# EasyEDA Pro project EasyEDA_ChisFlash_V1.0_Prometheus.epro

# Schematic ChisFlash-Prometheus
Create Date: 2024-07-21; Page Name: P1; Project Name: ChisFlash-Prometheus; Schematic Name: ChisFlash-Prometheus; Update Date: 2024-07-21; Company: ChisBread/ChisFlash-Prometheus; Drawed: ChisBread; Page Size: A4; Reviewed: ChisBread; Version: 2
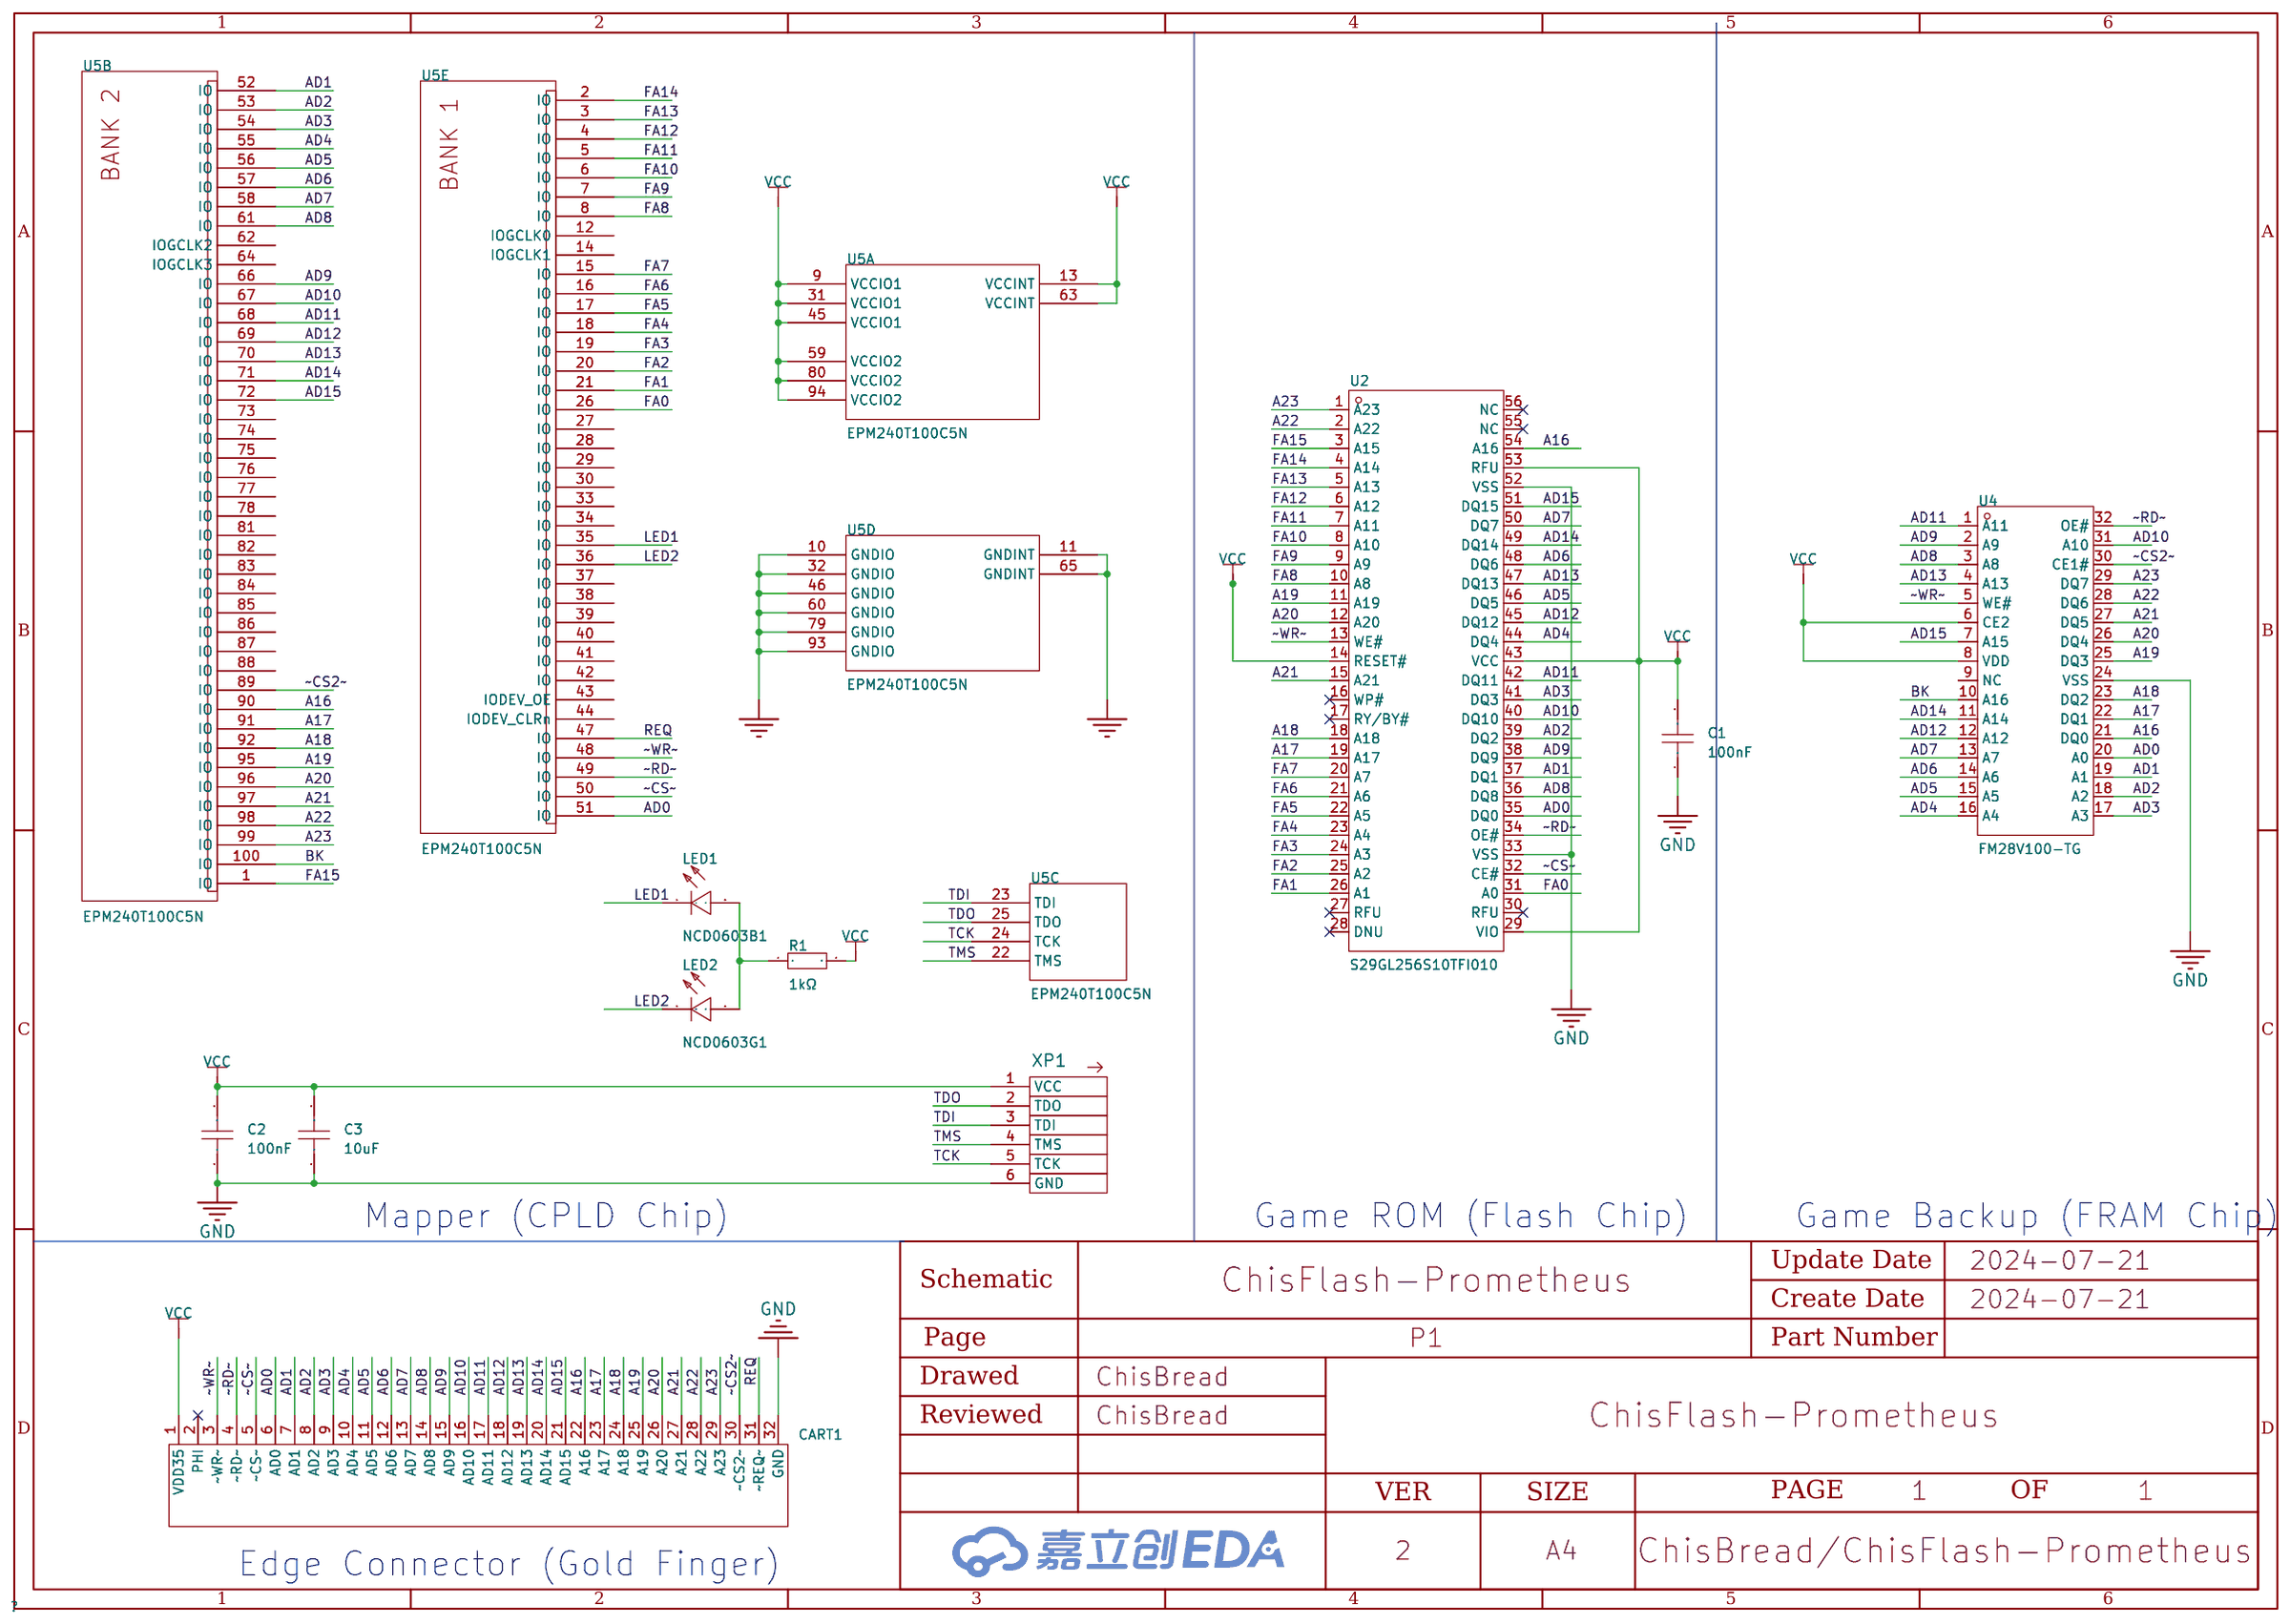
[diagram p0: schematic sheet]

## Parts
C1  100nF  [C0603]
C2  100nF  [C0603]
C3  10uF  [C0603]
CART1  -  [GBACartridge]  (no BOM)
LED1  NCD0603B1  [LED0603-RD]
LED2  NCD0603G1  [LED0603-RD]
R1  1kΩ  [R0603]
U2  S29GL256S10TFI010  [TSOP-56_L18.4-W14.0-P0.50-LS20.0-TL]
U4  FM28V100-TG  [STSOP-32_L8.0-W11.8-P0.50-LS13.4-TL]
U5  EPM240T100C5N  [TQFP-100_L14.0-W14.0-P0.50-LS16.0-BL]  (sections 1,2,3,4,5)
XP1  JTAG  [HDR-TH_6P-P1.27-V-M-1]  (no BOM)

## Library data of the parts
C1 C2 = CAP_0603: Supplier Footprint: 0603
C3 = CL10A106MA8NRNC: 容值:10uF;精度:±20%;额定电压:25V;材质(温度系数):X5R;; LCSC Part Name: 10uF ±20% 25V; Supplier Part: C96446; Manufacturer: SAMSUNG(三星); Supplier Footprint: 0603; JLCPCB Part Class: 基础库; Datasheet: https://atta.szlcsc.com/upload/public/pdf/source/20160218/1457707763339.pdf; Supplier: LCSC; Tolerance: ±20%; Voltage Rated: 25V; Temperature Coefficient: X5R
CART1 = GBACartridge: GBA Cartridge
LED1 = NCD0603B1: 发光颜色:蓝色;正向电压(VF):2.6V~3.6V;功率:72mW;正向电流:10mA;主波长:463nm~475nm;透镜颜色:无色透明透镜;发光强度:80mcd~220mcd;发光角度:130°;工作温度:-30℃~+85℃;; Supplier Part: C84266; Manufacturer: 国星光电; Supplier Footprint: 0603; JLCPCB Part Class: 扩展库; Datasheet: https://atta.szlcsc.com/upload/public/pdf/source/20200820/C84266_6A3CDBEFA72C6CAD68EDA53474ADAE6C.pdf; Supplier: LCSC; Emitted Color: 蓝色; Forward Voltage (VF): 2.6V~3.6V; Power Dissipation: 72mW; Forward Current: 10mA; Dominant Wavelength: 463nm~475nm; Lens Color: 无色透明透镜; Luminous Intensity: 80mcd~220mcd; Viewing Angle: 130°; Operating Temperature: -30℃~+85℃
LED2 = NCD0603G1: 发光颜色:翠绿色;正向电压(VF):2.6V~3.6V;功率:72mW;正向电流:10mA;主波长:515nm~530nm;透镜颜色:无色透明透镜;发光强度:330mcd~900mcd;发光角度:130°;工作温度:-30℃~+85℃;; Supplier Part: C84267; Manufacturer: 国星光电; Supplier Footprint: 0603; JLCPCB Part Class: 扩展库; Datasheet: https://atta.szlcsc.com/upload/public/pdf/source/20200820/C84267_04BA7703640BAC111D09F5EFB971FBF3.pdf; Supplier: LCSC; Emitted Color: 翠绿色; Forward Voltage (VF): 2.6V~3.6V; Power Dissipation: 72mW; Forward Current: 10mA; Dominant Wavelength: 515nm~530nm; Lens Color: 无色透明透镜; Luminous Intensity: 330mcd~900mcd; Viewing Angle: 130°; Operating Temperature: -30℃~+85℃
R1 = 0603WAF1001T5E: 电阻类型:厚膜电阻;阻值:1kΩ;精度:±1%;功率:100mW;最大工作电压:75V;温度系数:±100ppm/℃;; LCSC Part Name: 1kΩ ±1% 100mW 厚膜电阻; Supplier Part: C21190; Manufacturer: UNI-ROYAL(厚声); Supplier Footprint: 0603; JLCPCB Part Class: 基础库; Datasheet: https://atta.szlcsc.com/upload/public/pdf/source/20200306/C422600_1E6D84923E4A46A82E41ADD87F860B5C.pdf; Supplier: LCSC; Type: 厚膜电阻; Tolerance: ±1%; Power(Watts): 100mW; Overload Voltage (Max): 75V; Temperature Coefficient: ±100ppm/℃; Operating Temperature Range: -55℃~+155℃
U2 = S29GL256S10TFI010: Supplier Part: C1350995; Manufacturer: SPANSION(飞索); Supplier Footprint: TSOP-56; JLCPCB Part Class: Extended Part; Datasheet: https://atta.szlcsc.com/upload/public/pdf/source/20201109/C914940_4A5E28132C9BE0EE19A790F58F84C86D.pdf; Supplier: LCSC
U4 = FM28V100-TG: Supplier Part: C2959453; Manufacturer: CYPRESS(赛普拉斯); Supplier Footprint: TFSOP-32; JLCPCB Part Class: 扩展库; Datasheet: https://atta.szlcsc.com/upload/public/pdf/source/20210608/2F2AEFEDCE558E0D37969C616959BD3C.pdf; Supplier: LCSC
U5 = EPM240T100C5N: 类型:其它PLD;逻辑门数量:-;逻辑单元数:-;逻辑阵列块数:240;; Supplier Part: C10041; Manufacturer: Intel/Altera; Supplier Footprint: TQFP-100(14x14); JLCPCB Part Class: 扩展库; Datasheet: https://atta.szlcsc.com/upload/public/pdf/source/20121123/1457706563537.pdf; Supplier: LCSC; Type: 其它PLD; Supply Voltage Range - VCCIO: 3.3V；2.5V; Logic Array Blocks: 240; Maximum Delay Time Tpd: 4.7ns; Operating Temperature Range: 0℃~+85℃
XP1 = jtag

## Nets
GND: C1.1 C2.1 C3.1 CART1.32(GND) U2.33(VSS) U2.52(VSS) U4.24(VSS) U5.10(GNDIO) U5.11(GNDINT) U5.32(GNDIO) U5.46(GNDIO) U5.60(GNDIO) U5.65(GNDINT) U5.79(GNDIO) U5.93(GNDIO) XP1.6(GND)
VCC: C1.2 C2.2 C3.2 CART1.1(VDD35) R1.2 U2.14(RESET#) U2.29(VIO) U2.43(VCC) U2.53(RFU) U4.6(CE2) U4.8(VDD) U5.9(VCCIO1) U5.13(VCCINT) U5.31(VCCIO1) U5.45(VCCIO1) U5.59(VCCIO2) U5.63(VCCINT) U5.80(VCCIO2) U5.94(VCCIO2) XP1.1(VCC)
A16: CART1.22(A16) U2.54(A16) U4.21(DQ0) U5.90(IO)
A17: CART1.23(A17) U2.19(A17) U4.22(DQ1) U5.91(IO)
A18: CART1.24(A18) U2.18(A18) U4.23(DQ2) U5.92(IO)
A19: CART1.25(A19) U2.11(A19) U4.25(DQ3) U5.95(IO)
A20: CART1.26(A20) U2.12(A20) U4.26(DQ4) U5.96(IO)
A21: CART1.27(A21) U2.15(A21) U4.27(DQ5) U5.97(IO)
A22: CART1.28(A22) U2.2(A22) U4.28(DQ6) U5.98(IO)
A23: CART1.29(A23) U2.1(A23) U4.29(DQ7) U5.99(IO)
AD0: CART1.6(AD0) U2.35(DQ0) U4.20(A0) U5.51(IO)
AD1: CART1.7(AD1) U2.37(DQ1) U4.19(A1) U5.52(IO)
AD2: CART1.8(AD2) U2.39(DQ2) U4.18(A2) U5.53(IO)
AD3: CART1.9(AD3) U2.41(DQ3) U4.17(A3) U5.54(IO)
AD4: CART1.10(AD4) U2.44(DQ4) U4.16(A4) U5.55(IO)
AD5: CART1.11(AD5) U2.46(DQ5) U4.15(A5) U5.56(IO)
AD6: CART1.12(AD6) U2.48(DQ6) U4.14(A6) U5.57(IO)
AD7: CART1.13(AD7) U2.50(DQ7) U4.13(A7) U5.58(IO)
AD8: CART1.14(AD8) U2.36(DQ8) U4.3(A8) U5.61(IO)
AD9: CART1.15(AD9) U2.38(DQ9) U4.2(A9) U5.66(IO)
AD10: CART1.16(AD10) U2.40(DQ10) U4.31(A10) U5.67(IO)
AD11: CART1.17(AD11) U2.42(DQ11) U4.1(A11) U5.68(IO)
AD12: CART1.18(AD12) U2.45(DQ12) U4.12(A12) U5.69(IO)
AD13: CART1.19(AD13) U2.47(DQ13) U4.4(A13) U5.70(IO)
AD14: CART1.20(AD14) U2.49(DQ14) U4.11(A14) U5.71(IO)
AD15: CART1.21(AD15) U2.51(DQ15) U4.7(A15) U5.72(IO)
BK: U4.10(A16) U5.100(IO)
FA0: U2.31(A0) U5.26(IO)
FA1: U2.26(A1) U5.21(IO)
FA2: U2.25(A2) U5.20(IO)
FA3: U2.24(A3) U5.19(IO)
FA4: U2.23(A4) U5.18(IO)
FA5: U2.22(A5) U5.17(IO)
FA6: U2.21(A6) U5.16(IO)
FA7: U2.20(A7) U5.15(IO)
FA8: U2.10(A8) U5.8(IO)
FA9: U2.9(A9) U5.7(IO)
FA10: U2.8(A10) U5.6(IO)
FA11: U2.7(A11) U5.5(IO)
FA12: U2.6(A12) U5.4(IO)
FA13: U2.5(A13) U5.3(IO)
FA14: U2.4(A14) U5.2(IO)
FA15: U2.3(A15) U5.1(IO)
LED1: LED1.1(-) U5.35(IO)
LED2: LED2.1(K) U5.36(IO)
REQ: CART1.31(~REQ~) U5.47(IO)
TCK: U5.24(TCK) XP1.5(TCK)
TDI: U5.23(TDI) XP1.3(TDI)
TDO: U5.25(TDO) XP1.2(TDO)
TMS: U5.22(TMS) XP1.4(TMS)
~CS2~: CART1.30(~CS2~) U4.30(CE1#) U5.89(IO)
~CS~: CART1.5(~CS~) U2.32(CE#) U5.50(IO)
~RD~: CART1.4(~RD~) U2.34(OE#) U4.32(OE#) U5.49(IO)
~WR~: CART1.3(~WR~) U2.13(WE#) U4.5(WE#) U5.48(IO)
$1N77583: LED1.2(+) LED2.2(A) R1.1

Not connected (* = marked no-connect by the designer): CART1 2(PHI)*; U2 16(WP#)* 17(RY/BY#)* 27(RFU)* 28(DNU)* 30(RFU)* 55(NC)* 56(NC)*; U4 9(NC); U5 12(IOGCLK0) 14(IOGCLK1) 27(IO) 28(IO) 29(IO) 30(IO) 33(IO) 34(IO) 37(IO) 38(IO) 39(IO) 40(IO) 41(IO) 42(IO) 43(IODEV_OE) 44(IODEV_CLRn) 62(IOGCLK2) 64(IOGCLK3) 73(IO) 74(IO) 75(IO) 76(IO) 77(IO) 78(IO) 81(IO) 82(IO) 83(IO) 84(IO) 85(IO) 86(IO) 87(IO) 88(IO)

## Notes on the sheet
- Mapper (CPLD Chip)
- Game ROM (Flash Chip)
- Game Backup (FRAM Chip)
- Edge Connector (Gold Finger)

# Board ChisFlash-Prometheus
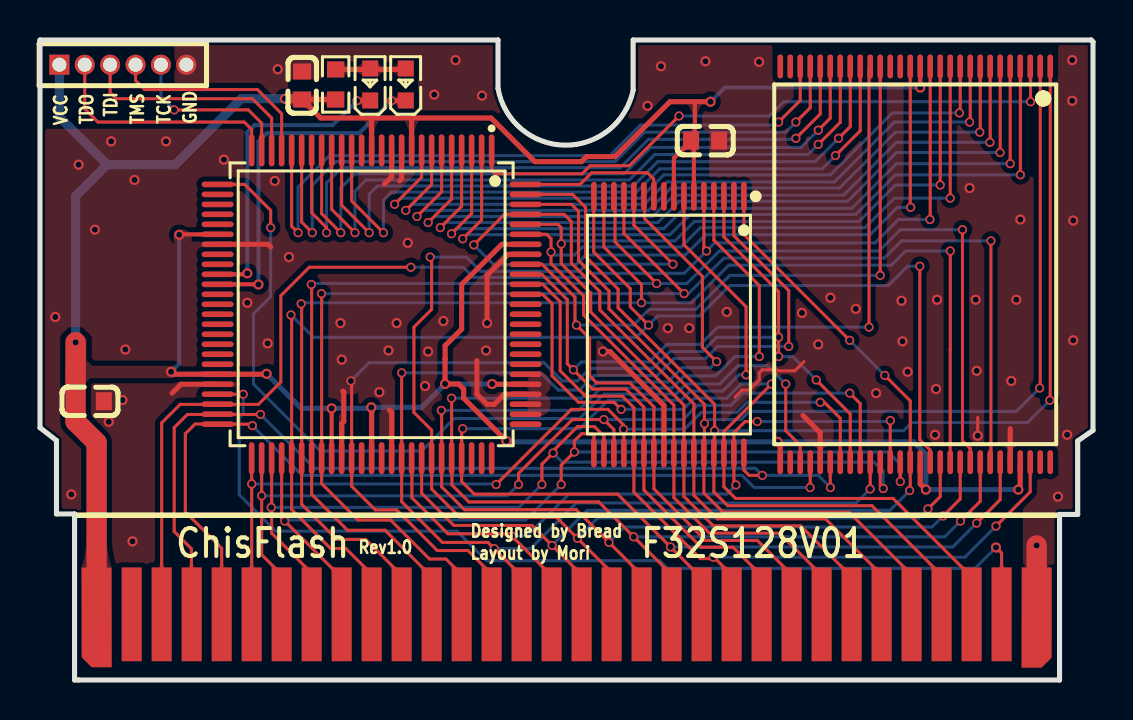
[diagram p1: board, top side]
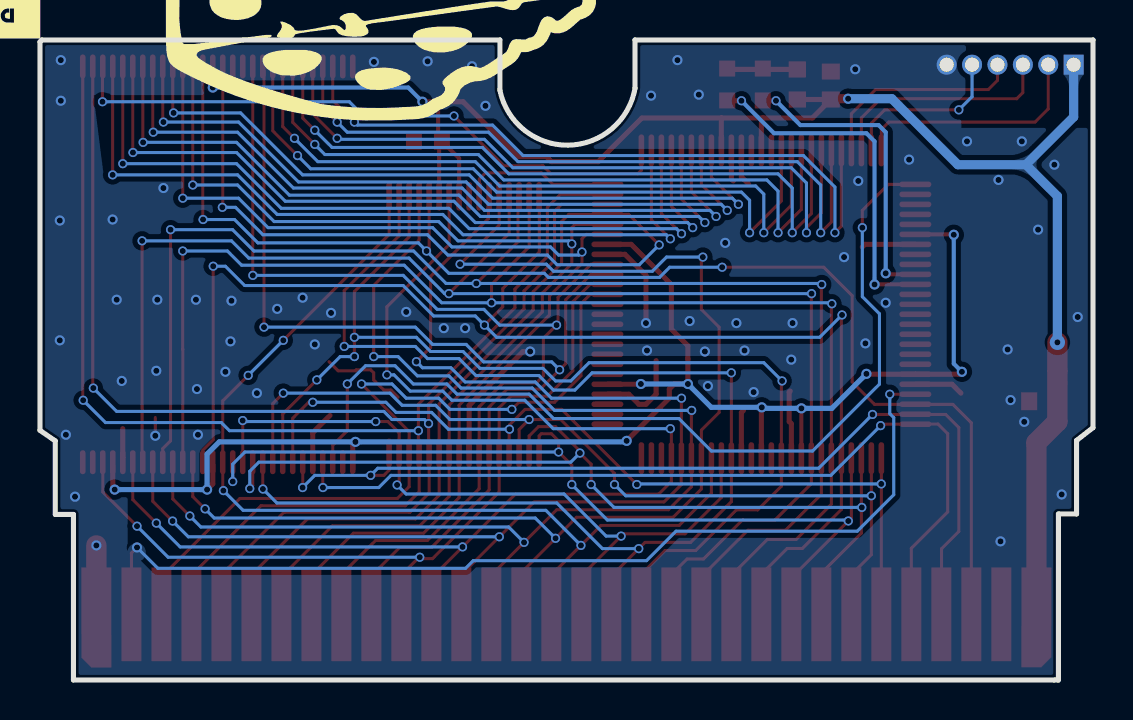
[diagram p2: board, bottom side, seen from below]

Outline 52.66 x 32.03 mm; copper layers: Top Layer, Bottom Layer. Coordinates in mm from the lower left corner of the outline.
Outline path: 0,32.03 22.9,32.03 22.9,29.6 arc(26.24,26.76) 29.66,29.51 29.66,32.03 52.56,32.03 52.66,31.93 52.66,12.49 51.89,11.96 51.89,8.29 50.98,8.29 50.98,0 1.93,0 1.73,0 1.73,8.31 0.82,8.31 0.82,11.98 0,12.63 0,32.03
Stack: Top Layer 0.035mm - / Dielectric1 1.51mm FR4 er 4.5 / Bottom Layer 0.035mm -

## Design rules (mm)
template: 自定义配置
spacing copperThickness1oz (default): track to track 0.152, other pairs 0.152 to 0.3
spacing copperThickness2oz: track to track 0.152, other pairs 0.152 to 0.3
track width copperThickness1oz (default): min 0.152, default 0.203, max 2.54
track width copperThickness2oz: min 0.152, default 0.254, max 2.54
differential pair differentialPair (default): width min 0.152, default 0.254, max 2.54; gap min 0.152, default 0.152
via viaSize (default): diameter min 0.406, default 0.508, max 10; hole min 0.305, default 0.305, max 6.299

## Placement (name value [footprint] x y rotation side)
C1  100nF  [C0603]  33.26 26.99 180 top
C2  100nF  [C0603]  13.11 29.75 270 top
C3  10uF  [C0603]  2.49 13.95 180 top
CART1  -  [GBACartridge]  26.31 18.09 0 top
LED1  NCD0603B1  [LED0603-RD]  16.51 29.8 90 top
LED2  NCD0603G1  [LED0603-RD]  18.29 29.8 90 top
R1  1kΩ  [R0603]  14.79 29.8 270 top
U2  S29GL256S10TFI010  [TSOP-56_L18.4-W14.0-P0.50-LS20.0-TL]  43.77 20.8 270 top
U4  FM28V100-TG  [STSOP-32_L8.0-W11.8-P0.50-LS13.4-TL]  31.45 17.78 270 top
U5  EPM240T100C5N  [TQFP-100_L14.0-W14.0-P0.50-LS16.0-BL]  16.58 18.8 180 top
XP1  JTAG  [HDR-TH_6P-P1.27-V-M-1]  4.14 30.79 0 top

## Footprints (pads in the part's own frame, mm; a bottom-side part is the same pattern mirrored in y, then rotated)
C0603
  rect 0.8x0.9 smd: 1(-0.7,0) 2(0.7,0)
GBACartridge
  custom 1.509x4.995 smd: 1(-23.479,-14.958)
  custom 1x4.691 smd: 2(-21.724,-14.806) 3(-20.224,-14.806) 4(-18.724,-14.806) 5(-17.224,-14.806) 6(-15.725,-14.806) 7(-14.225,-14.806) 8(-12.725,-14.806) 9(-11.225,-14.806) 10(-9.725,-14.806) 11(-8.225,-14.806) 12(-6.724,-14.806) 13(-5.224,-14.806) 14(-3.724,-14.806) 15(-2.224,-14.806) 16(-0.725,-14.806) 17(0.775,-14.806) 18(2.276,-14.806) 19(3.776,-14.806) 20(5.276,-14.806) 21(6.776,-14.806) 22(8.275,-14.806) 23(9.775,-14.806) 24(11.275,-14.806) 25(12.775,-14.806) 26(14.275,-14.806) 27(15.775,-14.806) 28(17.276,-14.806) 29(18.776,-14.806) 30(20.276,-14.806) 31(21.776,-14.806)
  custom 1.506x5.012 smd: 32(23.529,-14.966)
HDR-TH_6P-P1.27-V-M-1
  rect 1x1 hole 0.7: 1(-3.175,0)
  round 1 hole 0.7: 2(-1.905,0) 3(-0.635,0) 4(0.635,0) 5(1.905,0) 6(3.175,0)
LED0603-RD
  rect 0.8x0.8 smd: 1(-0.799,0) 2(0.799,0)
R0603
  rect 0.806x0.864 smd: 1(-0.753,0) 2(0.753,0)
STSOP-32_L8.0-W11.8-P0.50-LS13.4-TL
  oval 1.44x0.28 smd: 1(-6.42,3.75) 2(-6.42,3.25) 3(-6.42,2.75) 4(-6.42,2.25) 5(-6.42,1.75) 6(-6.42,1.25) 7(-6.42,0.75) 8(-6.42,0.25) 9(-6.42,-0.25) 10(-6.42,-0.75) 11(-6.42,-1.25) 12(-6.42,-1.75) 13(-6.42,-2.25) 14(-6.42,-2.75) 15(-6.42,-3.25) 16(-6.42,-3.75) 17(6.42,-3.75) 18(6.42,-3.25) 19(6.42,-2.75) 20(6.42,-2.25) 21(6.42,-1.75) 22(6.42,-1.25) 23(6.42,-0.75) 24(6.42,-0.25) 25(6.42,0.25) 26(6.42,0.75) 27(6.42,1.25) 28(6.42,1.75) 29(6.42,2.25) 30(6.42,2.75) 31(6.42,3.25) 32(6.42,3.75)
TQFP-100_L14.0-W14.0-P0.50-LS16.0-BL
  oval 0.28x1.6 smd: 1(-6,-7.7) 2(-5.5,-7.7) 3(-5,-7.7) 4(-4.5,-7.7) 5(-4,-7.7) 6(-3.5,-7.7) 7(-3,-7.7) 8(-2.5,-7.7) 9(-2,-7.7) 10(-1.5,-7.7) 11(-1,-7.7) 12(-0.5,-7.7) 13(0,-7.7) 14(0.5,-7.7) 15(1,-7.7) 16(1.5,-7.7) 17(2,-7.7) 18(2.5,-7.7) 19(3,-7.7) 20(3.5,-7.7) 21(4,-7.7) 22(4.5,-7.7) 23(5,-7.7) 24(5.5,-7.7) 25(6,-7.7) 51(6,7.7) 52(5.5,7.7) 53(5,7.7) 54(4.5,7.7) 55(4,7.7) 56(3.5,7.7) 57(3,7.7) 58(2.5,7.7) 59(2,7.7) 60(1.5,7.7) 61(1,7.7) 62(0.5,7.7) 63(0,7.7) 64(-0.5,7.7) 65(-1,7.7) 66(-1.5,7.7) 67(-2,7.7) 68(-2.5,7.7) 69(-3,7.7) 70(-3.5,7.7) 71(-4,7.7) 72(-4.5,7.7) 73(-5,7.7) 74(-5.5,7.7) 75(-6,7.7)
  oval 1.6x0.28 smd: 26(7.7,-6) 27(7.7,-5.5) 28(7.7,-5) 29(7.7,-4.5) 30(7.7,-4) 31(7.7,-3.5) 32(7.7,-3) 33(7.7,-2.5) 34(7.7,-2) 35(7.7,-1.5) 36(7.7,-1) 37(7.7,-0.5) 38(7.7,0) 39(7.7,0.5) 40(7.7,1) 41(7.7,1.5) 42(7.7,2) 43(7.7,2.5) 44(7.7,3) 45(7.7,3.5) 46(7.7,4) 47(7.7,4.5) 48(7.7,5) 49(7.7,5.5) 50(7.7,6) 76(-7.7,6) 77(-7.7,5.5) 78(-7.7,5) 79(-7.7,4.5) 80(-7.7,4) 81(-7.7,3.5) 82(-7.7,3) 83(-7.7,2.5) 84(-7.7,2) 85(-7.7,1.5) 86(-7.7,1) 87(-7.7,0.5) 88(-7.7,0) 89(-7.7,-0.5) 90(-7.7,-1) 91(-7.7,-1.5) 92(-7.7,-2) 93(-7.7,-2.5) 94(-7.7,-3) 95(-7.7,-3.5) 96(-7.7,-4) 97(-7.7,-4.5) 98(-7.7,-5) 99(-7.7,-5.5) 100(-7.7,-6)
TSOP-56_L18.4-W14.0-P0.50-LS20.0-TL
  oval 1.199x0.28 smd: 1(-9.901,6.752) 2(-9.901,6.251) 3(-9.901,5.75) 4(-9.901,5.25) 5(-9.901,4.75) 6(-9.901,4.25) 7(-9.901,3.749) 8(-9.901,3.251) 9(-9.901,2.751) 10(-9.901,2.251) 11(-9.901,1.75) 12(-9.901,1.25) 13(-9.901,0.75) 14(-9.901,0.249) 15(-9.901,-0.249) 16(-9.901,-0.75) 17(-9.901,-1.25) 18(-9.901,-1.75) 19(-9.901,-2.251) 20(-9.901,-2.751) 21(-9.901,-3.248) 22(-9.901,-3.749) 23(-9.901,-4.25) 24(-9.901,-4.75) 25(-9.901,-5.25) 26(-9.901,-5.75) 27(-9.901,-6.251) 28(-9.901,-6.749) 29(9.901,-6.749) 30(9.901,-6.251) 31(9.901,-5.75) 32(9.901,-5.25) 33(9.901,-4.75) 34(9.901,-4.25) 35(9.901,-3.749) 36(9.901,-3.248) 37(9.901,-2.751) 38(9.901,-2.251) 39(9.901,-1.75) 40(9.901,-1.25) 41(9.901,-0.75) 42(9.901,-0.249) 43(9.901,0.249) 44(9.901,0.75) 45(9.901,1.25) 46(9.901,1.75) 47(9.901,2.251) 48(9.901,2.751) 49(9.901,3.251) 50(9.901,3.749) 51(9.901,4.25) 52(9.901,4.75) 53(9.901,5.25) 54(9.901,5.75) 55(9.901,6.251) 56(9.901,6.752)

## Nets
As in the schematic.

Pads without a net: CART1 2; U2 16 17 27 28 30 55 56; U4 9; U5 12 14 27 28 29 30 33 34 37 38 39 40 41 42 43 44 62 64 73 74 75 76 77 78 81 82 83 84 85 86 87 88

## Via types
v1: diameter 0.457, hole 0.305, Top Layer to Bottom Layer, 122 vias
v2: diameter 0.508, hole 0.305, Top Layer to Bottom Layer, 81 vias
v3: diameter 0.762, hole 0.305, Top Layer to Bottom Layer, 1 via

## Routing (per net, layer and track width the routed paths; a pad name or vN(x,y) marks a point on that pad's centre or on a via; arc(x,y) is an arc through that point)
GND: length 44.3
  Top Layer w0.152: v2(46.89,12.22) 46.89,13.14 ; 38.2,15.93 37.75,15.47 36.88,15.47 36.83,15.52 36.12,15.52 35.97,15.37 35.97,15.02 35.46,14.51 35.11,14.51 34.75,14.15
  Top Layer w0.254: 39.02,10.52 39.02,12.37 38.15,13.24 ; U4.24 31.2,13.74 28.5,16.44 v2(28.15,16.44) ; 48.52,10.52 48.52,12.58 ; U5.79 23.21,14.3 22.71,13.8 22.35,13.8 21.85,14.3 21.85,15.98 ; U5.11 17.58,25.18 17.22,24.82 ; 17.48,13.49 17.58,13.39 U5.65 ; U5.10 18.08,25.07 17.99,24.97 ; U5.60 15.08,12.82 15.19,12.93 15.19,14.41 15.14,14.46 ; U5.46 7.05,14.8 6.61,14.36 ; U5.93 23.41,21.3 22.35,20.25 v2(22.35,17.86) ; 11.53,21.67 11.4,21.8 U5.32
  Top Layer w1.016: CART1.32 v2(49.84,6.73)
  vias: v2(0.76,18.16) v2(1.57,9.29) v2(1.93,25.78) v2(2.75,22.53) v2(3.44,12.92) v2(3.56,26.95) v2(4.12,14.01) v2(4.27,16.54) v2(4.63,6.94) v2(4.73,25.02) v2(6.3,26.95) v2(9.2,26.04) v2(10.37,18.88) v2(11.38,16.84) v2(11.74,24.97) v2(11.89,30.56) v2(12.45,21.16) v2(15.02,17.86) v2(15.09,16.03) v2(16.97,14.41) v2(17.43,16.49) v2(17.83,17.86) v2(18.39,21.87) v2(19.26,14.71) v2(19.41,16.44) v2(19.71,29.29) v2(20.17,17.96) v2(20.78,31.02) v2(22.1,29.24) v2(22.3,16.49) v2(30.38,28.73) v2(31.05,30.71) v2(31.4,17.61) v2(32.46,17.61) v2(33.27,30.96) v2(34.34,18.42) v2(35.96,30.93) v2(38.1,18.37) v2(38.92,16.79) v2(39.52,19.13) v2(40.79,18.57) v2(41.81,14.36) v2(43.08,18.98) v2(43.13,16.95) v2(43.39,15.42) v2(44.76,12.27) v2(44.86,19.03) v2(44.81,14.56) v2(46.48,24.62) v2(46.79,19.03) v2(46.84,15.47) v2(48.57,14.97) v2(48.82,19.03) v2(49.02,23.04) v2(50.9,9.17) v2(51.36,12.27) v2(51.61,31.02) v2(51.61,28.99) v2(51.67,22.99) v2(51.67,17)
VCC: length 167.1
  Top Layer w0.203: v2(6.96,22.28) 6.98,22.3 U5.31 ; 32.56,26.99 32.7,26.85 U4.6 ; 32.56,26.99 32.75,27.18 32.75,28.94 ; 32.56,26.99 32.56,26.97 31.7,26.1 U4.8 ; v2(44.02,29.65) U2.14 ; 14.58,13.59 U5.59
  Top Layer w0.254: R1.2 14.78,29.05 C2.2 14.03,28.12 16.51,28.12 ; 49.02,10.73 49.02,9.62 v2(48.92,9.53) ; 18.58,28.12 22.56,28.12 24.74,25.94 27.08,25.94 27.33,26.19 28.76,26.19 31.5,28.94 v2(33.53,28.94) ; 18.58,28.12 18.58,28.13 ; 18.58,28.12 16.51,28.12 ; 18.58,28.12 U5.9 ; 44.02,10.73 44.02,9.81 v2(44.3,9.53) ; v2(11.33,15.32) 11.31,15.3 U5.45 6.68,15.3 v2(6.56,15.42) ; U5.80 22.6,14.8 v2(22.61,14.81) ; U5.63 16.58,13.62 v2(16.56,13.64) ; 16.51,28.12 16.58,28.05 U5.13 ; 36.93,11.87 37.02,11.78 37.02,10.52 ; U5.94 23.09,21.8 21.08,19.79 21.08,17.56 20.26,16.73 20.26,16.08 20.26,16.08 v2(20.26,14.81) 20.93,14.81 21.19,14.56 21.19,14.1 v2(23.32,11.97)
  Top Layer w0.457: v2(12.24,29.09) 13.07,29.09 C2.2
  Top Layer w0.61: 1.83,15.42 1.78,15.47
  Top Layer w1.016: v3(1.78,16.89) 1.78,14.91 ; CART1.1 2.83,11.88 1.78,12.93 1.78,14.81
  Bottom Layer w0.203: v2(33.53,28.94) 34.24,29.65 v2(44.02,29.65) ; v2(6.56,15.42) 6.96,15.83 v2(6.96,22.28)
  Bottom Layer w0.254: v2(23.32,11.97) 23.37,11.92 v2(36.88,11.92) 43.69,11.92 44.3,11.31 v2(44.3,9.53) v2(48.92,9.53) ; v2(11.33,15.32) 13.06,13.59 v2(14.58,13.59) 16.51,13.59 v2(16.56,13.64) 19.09,13.64 v2(20.26,14.81) v2(22.61,14.81)
  Bottom Layer w0.457: v2(12.24,29.09) 10.06,29.09 6.76,25.78 3.36,25.78 ; 3.36,25.78 0.97,28.17 XP1.1 ; 3.36,25.78 1.78,24.21 v3(1.78,16.89)
A16: length 41.4
  Top Layer w0.152: v1(47.8,7.7) 49.52,9.41 49.52,10.73 ; U5.90 25.14,19.8 26.01,18.93 26.01,15.47 27.28,14.2 29.12,14.2 29.7,13.63 U4.21 29.7,9.4 33.02,6.08 33.6,6.08 v1(33.67,6.14) 33.7,6.14 34.58,5.26 CART1.22
  Bottom Layer w0.152: v1(33.67,6.14) 46.25,6.14 v1(47.8,7.7)
A17: length 52.8
  Top Layer w0.152: CART1.23 36.08,5.22 34.66,6.64 33.06,6.64 30.2,9.51 U4.22 30.2,13.66 29.29,14.56 27.64,14.56 v1(26.67,15.52) 26.37,15.83 26.37,19.03 25.1,20.3 U5.91 ; 41.52,30.53 41.45,30.47 v1(41.45,17.66)
  Bottom Layer w0.152: v1(41.45,17.66) 33.89,17.66 33.02,16.79 31.35,16.79 30.47,15.92 27.07,15.92 v1(26.67,15.52)
A18: length 52.5
  Top Layer w0.152: U5.92 24.29,20.81 25.1,20.81 26.75,19.15 26.75,17.83 v1(26.82,17.76) 27.48,17.1 27.48,15.22 27.84,14.86 29.5,14.86 30.7,13.67 U4.23 30.7,9.57 33.28,6.98 35.87,6.98 37.58,5.27 CART1.24 ; 42.02,30.53 42.02,20.25 v1(42.01,20.25)
  Bottom Layer w0.152: v1(42.01,20.25) 34.5,20.25 32.79,18.55 30.46,18.55 29.67,17.76 v1(26.82,17.76)
A19: length 55.4
  Top Layer w0.152: CART1.25 39.08,5.25 36.98,7.35 33.48,7.35 31.7,9.13 U4.25 31.7,13.75 27.18,18.27 27.18,19.21 25.55,20.84 v1(25.55,21.42) 25.55,22.08 25.33,22.3 U5.95 ; 45.52,30.53 v1(45.52,24.11)
  Bottom Layer w0.152: v1(45.52,24.11) 42.73,24.11 41.25,22.64 33.02,22.64 32.06,21.67 27.13,21.67 26.72,21.26 25.71,21.26 v1(25.55,21.42)
A20: length 55.7
  Top Layer w0.152: U5.96 25.9,22.8 26.06,22.64 v1(26.06,21.82) 26.06,20.84 27.54,19.36 27.54,18.42 32.2,13.76 U4.26 32.2,9.19 33.67,7.71 38.04,7.71 40.58,5.17 CART1.26 ; 45.02,30.53 v1(45.02,24.77)
  Bottom Layer w0.152: v1(45.02,24.77) 42.78,24.77 40.95,22.94 32.72,22.94 31.75,21.97 26.21,21.97 v1(26.06,21.82)
A21: length 63.3
  Top Layer w0.152: v1(43.54,23.65) 43.52,23.67 43.52,30.53 ; 42.14,5.2 39.28,8.06 33.88,8.06 32.7,9.24 U4.27 32.7,13.82 27.99,18.52 27.99,19.44 26.57,20.86 26.57,22.94 26.21,23.3 U5.97 23.22,23.3 v1(21.69,21.77)
  Bottom Layer w0.152: v1(43.54,23.65) 42.88,23.65 41.51,22.28 33.28,22.28 32.26,21.26 27.28,21.26 26.8,20.78 22.68,20.78 v1(21.69,21.77)
A22: length 67
  Top Layer w0.152: v1(49.99,14.61) 50.02,14.64 50.02,30.53 ; U5.98 26.57,23.8 26.93,23.45 26.93,20.99 28.45,19.47 28.45,18.57 33.22,13.8 33.22,11.39 U4.28 33.2,9.35 34.16,8.39 40.46,8.39 43.58,5.27 CART1.28
  Bottom Layer w0.152: v1(33.23,12.83) 33.43,13.03 35.05,13.03 35.46,13.44 48.82,13.44 v1(49.99,14.61)
A23: length 67.3
  Top Layer w0.152: v1(50.5,14) 50.52,14.02 50.52,30.53 ; 45.09,5.23 41.6,8.72 34.39,8.72 33.7,9.41 U4.29 33.73,11.4 v1(33.73,12.48) 33.73,13.8 28.91,18.62 28.91,19.56 27.28,21.19 27.28,23.65 26.63,24.3 U5.99
  Bottom Layer w0.152: v1(50.5,14) 49.38,12.88 43.59,12.88 43.18,12.48 v1(33.73,12.48)
AD0: length 43.6
  Top Layer w0.152: 29.2,11.41 29.2,12.53 v1(29.18,12.55) 29.18,12.76 28.4,13.54 26.57,13.54 v1(22.81,9.78) ; 40.02,10.73 40.02,13.1 39.22,13.9 v1(39.02,13.9) ; 10.58,10.9 CART1.6
  Bottom Layer w0.152: v1(10.59,9.81) 22.78,9.81 v1(22.81,9.78) ; v1(39.02,13.9) 35.36,13.9 34.85,13.39 33.07,13.39 32.23,12.55 v1(29.18,12.55)
AD1: length 45.8
  Top Layer w0.152: CART1.7 12.08,5.27 11.08,6.27 v1(11.08,9.22) U5.52 ; v1(40.49,14.36) 41.02,13.83 41.02,10.73 ; v1(23.93,9.78) 23.93,10.34 26.62,13.03 v1(28.2,13.03) 28.7,12.53 28.7,11.41
  Bottom Layer w0.152: v1(23.93,9.78) 23.36,9.22 v1(11.08,9.22) ; v1(28.2,13.03) 32.16,13.03 32.87,13.75 34.55,13.75 35.16,14.36 v1(40.49,14.36)
AD2: length 47.6
  Top Layer w0.152: 28.2,11.41 28.2,12.21 27.73,12.68 26.88,12.68 25.66,11.46 v1(25.66,11.36) 25.1,10.8 v1(25.1,9.78) ; 42.02,10.73 42.02,9.73 v1(42.17,9.58) ; CART1.8 13.58,5.34 11.58,7.35 U5.53
  Bottom Layer w0.152: v1(11.56,8.64) 23.95,8.64 v1(25.1,9.78) ; v1(25.66,11.36) 26.11,10.9 41.71,10.9 42.17,10.44 v1(42.17,9.58)
AD3: length 46.3
  Top Layer w0.152: v1(43.02,9.93) 43.02,10.73 ; CART1.9 14.94,3.43 14.94,5.26 v1(12.24,7.96) 12.08,8.11 U5.54 ; v1(26.06,9.78) 26.06,10.75 v1(26.72,11.41) 26.72,11.97 27.08,12.32 27.59,12.32 27.7,12.21 U4.17
  Bottom Layer w0.152: v1(12.24,7.96) 12.28,8.01 24.29,8.01 v1(26.06,9.78) ; v1(43.02,9.93) 43.02,10.8 42.41,11.41 v1(26.72,11.41)
AD4: length 68.3
  Top Layer w0.152: 44.52,10.73 44.52,11.5 43.99,12.02 v1(43.99,20.7) ; v1(30.43,17.76) 29.52,18.67 29.52,19.59 27.69,21.42 27.69,24.26 ; v1(12.55,18.27) 12.58,18.23 U5.55 12.58,8.53 14.53,6.58 15.29,6.58 16.51,5.36 16.51,3.36 CART1.10
  Bottom Layer w0.152: v1(12.55,18.27) 13.67,17.15 29.82,17.15 v1(30.43,17.76) 30.89,18.22 32.97,18.22 34.5,19.74 42.42,19.74 43.39,20.7 v1(43.99,20.7)
AD5: length 68.9
  Top Layer w0.152: v1(45.52,21.47) 45.52,16.55 45.52,16.55 45.52,10.73 ; v1(13.06,18.83) 13.08,18.8 U5.56 13.08,8.79 14.84,7.04 16.28,7.04 18.04,5.28 18.04,3.34 CART1.11 ; 28.2,24.25 28.2,21.67 30.08,19.79 v1(30.08,18.88)
  Bottom Layer w0.152: v1(13.06,18.83) 13.11,18.88 v1(30.08,18.88) 32.57,18.88 34.44,20.76 42.57,20.76 43.28,21.47 v1(45.52,21.47)
AD6: length 71.1
  Top Layer w0.152: v1(13.57,19.79) 13.58,19.77 U5.57 13.58,9.29 15.38,7.49 17.26,7.49 19.58,5.16 CART1.12 ; v1(46.13,22.53) 46.13,11.97 46.52,11.58 46.52,10.73 ; 28.65,24.3 28.76,24.2 28.76,21.92 v1(30.84,19.84)
  Bottom Layer w0.152: v1(13.57,19.79) 13.62,19.84 v1(30.84,19.84) 32.35,19.84 33.97,21.47 41.96,21.47 43.03,22.53 v1(46.13,22.53)
AD7: length 70.4
  Top Layer w0.152: v1(47.55,21.97) 47.55,10.76 47.52,10.73 ; v1(14.07,19.33) 14.08,19.32 U5.58 14.08,9.83 15.9,8 17.53,8 19.48,6.06 20.3,6.06 21.06,5.3 ; v1(32.21,19.33) 29.2,22.35 29.2,24.25
  Bottom Layer w0.152: v1(14.07,19.33) v1(32.21,19.33) 32.42,19.33 34.2,21.11 42.22,21.11 43.08,21.97 v1(47.55,21.97)
AD8: length 53.6
  Top Layer w0.152: v1(38.81,15.02) 40.52,13.31 40.52,10.73 ; v1(15.55,14.97) 15.58,14.93 U5.61 15.58,9.7 16.77,8.51 17.83,8.51 19.87,6.48 21.4,6.48 22.45,5.43 22.45,5.36 ; 34.2,24.25 34.2,22.17 36.93,19.44 v1(36.93,17.15) v1(36.93,16.18)
  Bottom Layer w0.152: v1(15.55,14.97) 16.46,15.88 25.2,15.88 26.11,14.97 26.88,14.97 27.5,15.59 30.65,15.59 31.5,16.44 33.12,16.44 33.83,17.15 v1(36.93,17.15) ; v1(36.93,16.18) 37.64,16.18 v1(38.81,15.02)
AD9: length 64.4
  Top Layer w0.152: 24,5.26 24,5.28 v1(22.71,6.57) 22.4,6.89 20.12,6.89 18.08,8.92 U5.66 18.08,15.37 v1(18.09,15.37) ; 41.52,10.73 41.52,9.56 v1(41.51,9.56) ; v1(37.44,16.69) 37.44,19.49 34.7,22.23 34.7,24.25
  Bottom Layer w0.152: v1(18.09,15.37) 25.05,15.37 25.91,14.51 26.98,14.51 27.7,15.24 30.86,15.24 31.7,16.08 33.28,16.08 33.89,16.69 v1(37.44,16.69) ; v1(41.51,9.56) 40.81,8.86 26.82,8.86 24.53,6.57 v1(22.71,6.57)
AD10: length 37.3
  Top Layer w0.152: 18.54,10.62 18.6,10.57 18.6,9.12 20.4,7.32 23.48,7.32 v1(23.6,7.2) 25.58,5.21 CART1.16 ; U4.31 34.7,9.86 v1(34.8,9.76) ; 42.52,10.73 42.52,12.98 v1(42.52,12.98) ; v1(35.87,12.93) 35.26,12.93 34.7,12.37 34.7,11.42
  Bottom Layer w0.152: v1(34.8,9.76) 34.35,9.31 26.45,9.31 24.35,7.2 v1(23.6,7.2) ; v1(35.87,12.93) 42.47,12.93 v1(42.52,12.98)
AD11: length 50.6
  Top Layer w0.152: v1(42.24,15.24) 43.52,13.97 43.52,9.51 v1(43.49,9.48) ; U5.68 19.08,9.35 20.69,7.73 24.61,7.73 v1(25.61,6.73) 27.08,5.26 CART1.17 ; U4.1 35.2,22.29 v1(40.49,17)
  Bottom Layer w0.152: v1(43.49,9.48) 42.5,8.49 27.36,8.49 v1(25.61,6.73) ; v1(40.49,17) v1(42.24,15.24)
AD12: length 62.5
  Top Layer w0.152: CART1.18 28.58,5.38 v1(26.88,7.09) 25.82,8.14 21,8.14 19.58,9.56 U5.69 19.58,12.5 18.7,13.39 18.7,17.66 19.58,18.54 19.58,21.09 v1(19.51,21.16) ; v1(31.65,20.81) 29.7,22.76 U4.12 ; 45.02,10.73 45.02,9.18 v1(44.4,8.56)
  Bottom Layer w0.152: v1(44.4,8.56) 43.94,8.11 27.89,8.11 v1(26.88,7.09) ; v1(19.51,21.16) 21.33,21.16 22.04,20.45 26.98,20.45 27.33,20.81 v1(31.65,20.81)
AD13: length 62.2
  Top Layer w0.152: v1(20.07,13.49) 20.08,13.48 U5.70 20.08,9.67 21.23,8.52 26.82,8.52 v1(28.45,6.89) 30.22,5.11 30.22,4.91 ; v1(35.97,16.18) 35.97,19.74 33.7,22.01 U4.4 ; v1(45.16,8.21) 46.02,9.06 46.02,10.73
  Bottom Layer w0.152: v1(35.97,16.18) 34.75,16.18 33.78,15.22 32.21,15.22 31.6,14.61 28.04,14.61 26.93,13.49 v1(20.07,13.49) ; v1(45.16,8.21) 44.61,7.66 29.22,7.66 v1(28.45,6.89)
AD14: length 60.9
  Top Layer w0.152: 47.02,10.73 47.02,8.94 v1(46.03,7.95) ; v1(20.58,14.1) 20.58,14.09 U5.71 ; 31.53,4.76 31.53,5.32 v1(29.69,7.17) 27.94,8.91 21.45,8.91 20.6,9.76 20.6,10.71 ; U4.11 30.23,24.17 30.23,23.09 33.12,20.2 33.12,16.64 v1(33.83,15.93)
  Bottom Layer w0.152: v1(33.83,15.93) 33.53,15.62 32.11,15.62 31.4,14.91 27.89,14.91 27.08,14.1 v1(20.58,14.1) ; v1(29.69,7.17) 45.24,7.17 v1(46.03,7.95)
AD15: length 63.2
  Top Layer w0.152: U4.7 32.2,21.78 35.31,18.67 v1(35.31,15.27) ; 48.02,10.73 48.02,9.03 v1(46.84,7.85) ; v1(21.14,12.58) 21.08,12.52 U5.72 21.08,9.94 21.72,9.3 28.88,9.3 v1(31.53,6.66) 33.08,5.1 CART1.21
  Bottom Layer w0.152: v1(35.31,15.27) 34.95,15.27 34.14,14.46 32.51,14.46 32.06,14 28.41,14 26.99,12.58 v1(21.14,12.58) ; v1(46.84,7.85) 45.65,6.66 v1(31.53,6.66)
BK: length 7.6
  Top Layer w0.152: U4.10 30.69,24.22 30.69,25.07 30.38,25.38 27.59,25.38 27.01,24.8 U5.100
FA0: length 46.8
  Top Layer w0.152: U5.26 10.23,24.8 11.53,23.5 v1(11.53,22.64) ; 38.02,10.73 38.02,11.75 37.29,12.48 v1(37.29,14.81)
  Bottom Layer w0.152: v1(11.53,22.64) 11.53,19.18 10.68,18.33 10.68,14.8 14.02,11.46 19.08,11.46 20.71,13.08 26.98,13.08 28.2,14.3 31.8,14.3 32.31,14.81 33.99,14.81 34.9,15.73 36.38,15.73 v1(37.29,14.81)
FA1: length 35
  Top Layer w0.152: v1(36.93,27.92) 38.02,29 38.02,30.53 ; U5.21 12.58,22.7 v1(12.91,22.38)
  Bottom Layer w0.152: v1(36.93,27.92) 36.78,27.77 30.02,27.77 28.5,26.24 14.48,26.24 12.91,24.67 v1(12.91,22.38)
FA2: length 35.1
  Top Layer w0.152: U5.20 13.08,22.92 v1(13.62,22.38) ; 38.52,30.53 38.52,28.64 v1(37.8,27.92)
  Bottom Layer w0.152: v1(37.8,27.92) 37.29,27.41 30.23,27.41 28.76,25.94 14.79,25.94 13.62,24.77 v1(13.62,22.38)
FA3: length 35.2
  Top Layer w0.152: U5.19 13.58,23.38 14.33,22.64 v1(14.33,22.38) ; 39.02,30.53 39.02,28.33 v1(37.8,27.11)
  Bottom Layer w0.152: v1(37.8,27.11) 37.75,27.05 30.43,27.05 29.01,25.63 15.09,25.63 14.33,24.87 v1(14.33,22.38)
FA4: length 35.1
  Top Layer w0.152: v1(15.04,22.38) 14.08,23.34 U5.18 ; 39.52,30.53 39.52,28.11 v1(38.92,27.51)
  Bottom Layer w0.152: v1(38.92,27.51) 38.05,26.65 30.53,26.65 29.21,25.33 15.75,25.33 15.04,24.62 v1(15.04,22.38)
FA5: length 35
  Top Layer w0.152: v1(15.75,22.38) 14.58,23.55 U5.17 ; 40.02,30.53 40.02,27.9 v1(38.92,26.8)
  Bottom Layer w0.152: v1(38.92,26.8) 38.41,26.29 30.74,26.29 29.47,25.02 16.31,25.02 15.75,24.46 v1(15.75,22.38)
FA6: length 34.9
  Top Layer w0.152: 40.52,30.53 40.52,27.69 v1(39.93,27.11) ; v1(16.46,22.38) 15.08,23.76 U5.16
  Bottom Layer w0.152: v1(16.46,22.38) 16.46,24.31 16.87,24.72 29.67,24.72 30.89,25.94 38.76,25.94 v1(39.93,27.11)
FA7: length 34.7
  Top Layer w0.152: v1(39.78,26.24) 41.02,27.48 41.02,30.53 ; U5.15 15.58,23.97 v1(17.17,22.38)
  Bottom Layer w0.152: v1(39.78,26.24) 39.12,25.58 30.99,25.58 29.82,24.41 17.58,24.41 17.17,24.01 v1(17.17,22.38)
FA8: length 35.6
  Top Layer w0.152: 46.02,30.53 46.02,28.42 v1(45.98,28.38) ; U5.8 19.08,25.16 v1(17.73,23.8)
  Bottom Layer w0.152: v1(17.73,23.8) 18.04,24.11 30.02,24.11 31.19,25.28 39.52,25.28 42.62,28.38 v1(45.98,28.38)
FA9: length 36.2
  Top Layer w0.152: 46.52,30.53 46.52,27.95 v1(46.48,27.92) ; U5.7 19.58,24.79 v1(18.29,23.5)
  Bottom Layer w0.152: v1(18.29,23.5) 18.6,23.8 30.23,23.8 31.35,24.92 39.73,24.92 42.73,27.92 v1(46.48,27.92)
FA10: length 36.8
  Top Layer w0.152: v1(18.85,23.19) 20.08,24.43 U5.6 ; 47.02,30.53 47.02,27.44 v1(46.99,27.41)
  Bottom Layer w0.152: v1(46.99,27.41) 42.78,27.41 39.98,24.62 31.55,24.62 30.43,23.5 19.15,23.5 v1(18.85,23.19)
FA11: length 37.5
  Top Layer w0.152: 47.52,30.53 47.52,26.92 v1(47.5,26.9) ; U5.5 20.58,24.06 v1(19.41,22.89)
  Bottom Layer w0.152: v1(47.5,26.9) 42.83,26.9 40.18,24.26 31.7,24.26 30.63,23.19 19.71,23.19 v1(19.41,22.89)
FA12: length 38
  Top Layer w0.152: v1(20.02,22.64) 21.08,23.7 U5.4 ; 48.02,30.53 48.02,26.4 v1(48.01,26.39)
  Bottom Layer w0.152: v1(20.02,22.64) 20.27,22.89 30.89,22.89 31.96,23.96 40.39,23.96 42.83,26.39 v1(48.01,26.39)
FA13: length 38.7
  Top Layer w0.152: U5.3 21.58,23.34 v1(20.58,22.33) ; v1(48.52,25.84) 48.52,30.53
  Bottom Layer w0.152: v1(20.58,22.33) 20.83,22.58 31.19,22.58 32.21,23.6 40.59,23.6 42.83,25.84 v1(48.52,25.84)
FA14: length 39.3
  Top Layer w0.152: v1(49.02,25.28) 49.02,30.52 49.02,30.53 ; U5.2 22.08,23.02 v1(21.14,22.08)
  Bottom Layer w0.152: v1(49.02,25.28) 42.78,25.28 40.79,23.3 32.51,23.3 31.5,22.28 21.34,22.28 v1(21.14,22.08)
FA15: length 31.1
  Top Layer w0.152: v1(31.96,28.22) 29.47,25.73 27.51,25.73 27.11,25.33 22.76,25.33 22.58,25.51 U5.1 ; v1(49.53,28.94) 49.53,30.51 49.52,30.53
  Bottom Layer w0.152: v1(49.53,28.94) 37.19,28.94 36.48,28.22 v1(31.96,28.22)
LED1: length 15.4
  Top Layer w0.203: U5.35 10.32,20.3 v2(10.37,20.35)
  Top Layer w0.254: 16.51,29 16.5,28.99 v1(15.85,28.99)
  Bottom Layer w0.203: v2(10.37,20.35) 10.37,27.41 10.72,27.77 14.63,27.77 v1(15.85,28.99)
LED2: length 17.4
  Top Layer w0.203: 10.92,19.8 U5.36
  Top Layer w0.254: v1(17.58,28.99) 18.28,28.99 18.29,29 ; v2(10.92,19.79) 10.92,19.8
  Bottom Layer w0.203: v2(10.92,19.79) 10.92,26.95 11.33,27.36 15.95,27.36 v1(17.58,28.99)
REQ: length 49.7
  Top Layer w0.152: CART1.31 48.08,6.35 v2(47.8,6.63) ; U5.47 v1(10.16,14.3)
  Bottom Layer w0.152: v2(47.8,6.63) 46.76,5.59 31.38,5.59 30.99,5.97 22.33,5.97 20.85,7.45 11.79,7.45 9.96,9.27 9.96,13.13 10.16,13.33 v1(10.16,14.3)
TCK: length 8.5
  Top Layer w0.152: U5.24 11.08,27.86 10.42,28.53 v1(6.71,28.53)
  Bottom Layer w0.152: XP1.5 6.05,29.19 v1(6.71,28.53)
TDI: length 11.6
  Top Layer w0.152: U5.23 11.58,28.12 10.62,29.09 3.81,29.09 3.51,29.39 XP1.3
TDO: length 12
  Top Layer w0.152: XP1.2 2.24,28.58 2.9,27.92 10.21,27.92 10.58,27.55 U5.25
TMS: length 10.6
  Top Layer w0.152: XP1.4 4.78,30 5.23,29.54 10.87,29.54 12.08,28.33 U5.22
~CS2~: length 39.6
  Top Layer w0.152: CART1.30 46.58,5.16 42.66,9.08 34.79,9.08 34.2,9.67 U4.30 34.2,12.43 v1(36.58,14.81) ; U5.89 25.13,19.3 25.61,18.83 25.61,15.22 26.93,13.9 28.7,13.9 v1(29.06,13.54)
  Bottom Layer w0.152: v1(29.06,13.54) 32.16,13.54 32.72,14.1 34.34,14.1 35.05,14.81 v1(36.58,14.81)
~CS~: length 43.7
  Top Layer w0.152: v1(10.62,12.73) 10.55,12.8 U5.50 ; CART1.5 9.08,6.59 7.27,8.41 7.27,12.32 7.75,12.81 8.97,12.81 ; v1(38.51,9.63) 38.52,9.64 38.52,10.73
  Bottom Layer w0.152: v1(38.51,9.63) 35.71,9.63 35.11,10.24 13.11,10.24 v1(10.62,12.73)
~RD~: length 47.3
  Top Layer w0.152: v1(36.12,10.24) 35.46,10.24 35.2,10.5 U4.32 ; CART1.4 7.57,3.3 7.57,6.57 6.71,7.43 6.71,12.63 7.37,13.29 v1(11.03,13.29) ; 39.52,10.73 39.52,9.64 v1(39.52,9.63)
  Bottom Layer w0.152: v1(39.52,9.63) 38.92,10.24 v1(36.12,10.24) 35.77,10.6 13.72,10.6 v1(11.03,13.29)
~WR~: length 65.4
  Top Layer w0.152: CART1.3 6.08,12.87 7.01,13.79 10.92,13.79 12.04,14.91 12.04,19.23 13.46,20.65 v1(18.54,20.65) ; v1(44.5,23.04) 44.52,23.05 44.52,30.53 ; v1(33.33,21.47) 33.2,21.6 U4.5
  Bottom Layer w0.152: v1(44.5,23.04) 42.93,23.04 41.76,21.87 33.73,21.87 v1(33.33,21.47) 32.21,20.35 27.43,20.35 27.23,20.15 21.68,20.15 21.17,20.65 v1(18.54,20.65)
$1N77583: length 3.5
  Top Layer w0.254: LED2.2 18.24,30.55 R1.1

## Copper pours and planes (outline as drawn; the poured copper is in the pictures)
GND on Top Layer: -4.06,34.37 58.02,34.37 58.02,-4.49 -4.06,-4.49
GND on Bottom Layer: -4.47,34.78 57.05,34.78 57.05,-4.24 -4.47,-4.24
VCC on Top Layer: 1.27,17.41 6.83,17.41 6.83,14.47 1.27,14.47

Small or netless copper shapes (teardrops, artwork), in the pictures only: 398 on Top Layer, 153 on Bottom Layer

## Text on the board
Top Silkscreen Layer: Rev1.0 | Designed by Bread | Layout by Mori | TDO | TDI | TMS | TCK | GND | VCC | ChisFlash                F32S128V01
